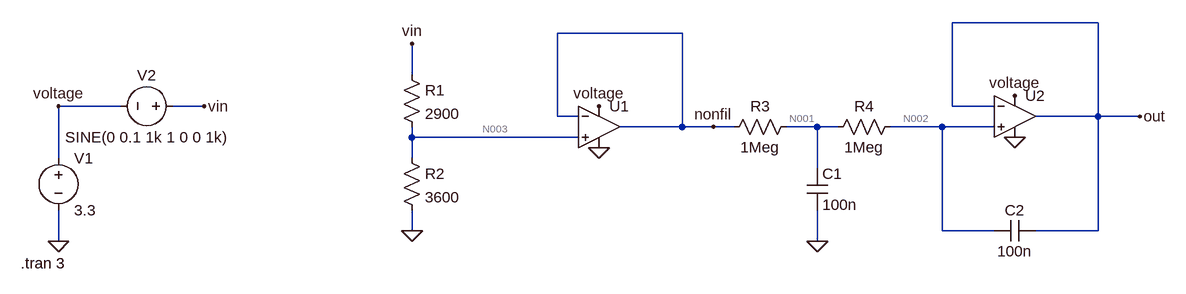
[diagram p0: schematic BEST.asc]
BEST.asc, the LTspice schematic file:
Version 4
SHEET 1 1704 680
WIRE 1584 -32 1360 -32
WIRE 944 -16 752 -16
WIRE 528 48 528 0
WIRE 80 96 -16 96
WIRE 208 96 160 96
WIRE 1360 96 1360 -32
WIRE 1424 96 1360 96
WIRE 752 112 752 -16
WIRE 784 112 752 112
WIRE 1584 112 1584 -32
WIRE 1584 112 1488 112
WIRE 1648 112 1584 112
WIRE 944 128 944 -16
WIRE 944 128 848 128
WIRE 992 128 944 128
WIRE 1024 128 992 128
WIRE 1152 128 1104 128
WIRE 1184 128 1152 128
WIRE 1344 128 1264 128
WIRE 1424 128 1344 128
WIRE 528 144 528 128
WIRE 784 144 528 144
WIRE -16 176 -16 96
WIRE 528 176 528 144
WIRE 1152 192 1152 128
WIRE 528 288 528 256
WIRE 1344 288 1344 128
WIRE 1424 288 1344 288
WIRE 1584 288 1584 112
WIRE 1584 288 1488 288
WIRE -16 304 -16 256
WIRE 1152 304 1152 256
FLAG -16 304 0
FLAG -16 96 voltage
FLAG 208 96 vin
FLAG 816 96 voltage
FLAG 1456 80 voltage
FLAG 1456 144 0
FLAG 816 160 0
FLAG 528 288 0
FLAG 528 0 vin
FLAG 1152 304 0
FLAG 1648 112 out
FLAG 992 128 nonfil
SYMBOL voltage -16 160 R0
WINDOW 123 0 0 Left 0
WINDOW 39 0 0 Left 0
SYMATTR InstName V1
SYMATTR Value 3.3
SYMBOL voltage 176 96 R90
WINDOW 0 -32 56 VBottom 2
WINDOW 3 32 56 VTop 2
WINDOW 123 0 0 Left 0
WINDOW 39 0 0 Left 0
SYMATTR InstName V2
SYMATTR Value SINE(0 0.1 1k 1 0 0 1k)
SYMBOL res 512 32 R0
SYMATTR InstName R1
SYMATTR Value 2900
SYMBOL res 512 160 R0
SYMATTR InstName R2
SYMATTR Value 3600
SYMBOL OpAmps\\UniversalOpAmp2 816 128 R0
SYMATTR InstName U1
SYMBOL OpAmps\\UniversalOpAmp2 1456 112 R0
SYMATTR InstName U2
SYMBOL res 1120 112 R90
WINDOW 0 0 56 VBottom 2
WINDOW 3 32 56 VTop 2
SYMATTR InstName R3
SYMATTR Value 1Meg
SYMBOL res 1280 112 R90
WINDOW 0 0 56 VBottom 2
WINDOW 3 32 56 VTop 2
SYMATTR InstName R4
SYMATTR Value 1Meg
SYMBOL cap 1136 192 R0
SYMATTR InstName C1
SYMATTR Value 100n
SYMBOL cap 1488 272 R90
WINDOW 0 0 32 VBottom 2
WINDOW 3 32 32 VTop 2
SYMATTR InstName C2
SYMATTR Value 100n
TEXT -74 338 Left 2 !.tran 3

The netlist it stands for:
* BEST.asc
V1 voltage 0 3.3
V2 vin voltage SINE(0 0.1 1k 1 0 0 1k)
R1 vin N003 2900
R2 N003 0 3600
XU1 N003 nonfil voltage 0 nonfil level2 Avol=1Meg GBW=10Meg Slew=10Meg Ilimit=25m Rail=0 Vos=0 En=0 Enk=0 In=0 Ink=0 Rin=500Meg  ; pins In+ In- V+ V- OUT
XU2 N002 out voltage 0 out level2 Avol=1Meg GBW=10Meg Slew=10Meg Ilimit=25m Rail=0 Vos=0 En=0 Enk=0 In=0 Ink=0 Rin=500Meg  ; pins In+ In- V+ V- OUT
R3 N001 nonfil 1Meg
R4 N002 N001 1Meg
C1 N001 0 100n
C2 out N002 100n
.tran 3
.lib UniversalOpAmp2.lib
.backanno
.end

* Results of the author's LTspice run, read from the files saved beside the schematic
* Operating Point, zero values left out:
*   V(voltage) = 3.3 V
*   V(vin) = 3.3 V
*   V(n003) = 1.828 V
*   V(nonfil) = 1.828 V
*   V(out) = 1.827 V
*   V(n002) = 1.827 V
*   V(n001) = 1.827 V
*   I(R4) = -354 pA
*   I(R3) = -354 pA
*   I(R2) = 507.7 µA
*   I(R1) = 507.7 µA
*   I(V2) = -507.7 µA
*   I(V1) = -835.8 µA
*   Ix(u1:1) = 355.4 pA
*   Ix(u1:2) = 355.4 pA
*   Ix(u1:3) = 164 µA
*   Ix(u1:4) = -164.1 µA
*   Ix(u1:5) = -709.4 pA
*   Ix(u2:1) = 354 pA
*   Ix(u2:2) = 354 pA
*   Ix(u2:3) = 164.1 µA
*   Ix(u2:4) = -164.1 µA
*   Ix(u2:5) = -354 pA
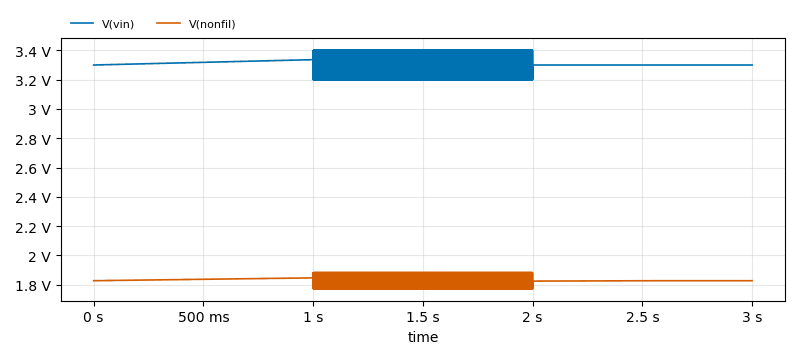
[diagram p1: Transient Analysis of BEST.asc, plotted from the saved traces]
* Transient Analysis, 1 run:
*   V(vin): min 3.2 V, max 3.4 V, average 3.3 V, rms 3.3 V, last 3.3 V
*   V(nonfil): min 1.772 V, max 1.883 V, average 1.828 V, rms 1.828 V, last 1.828 V